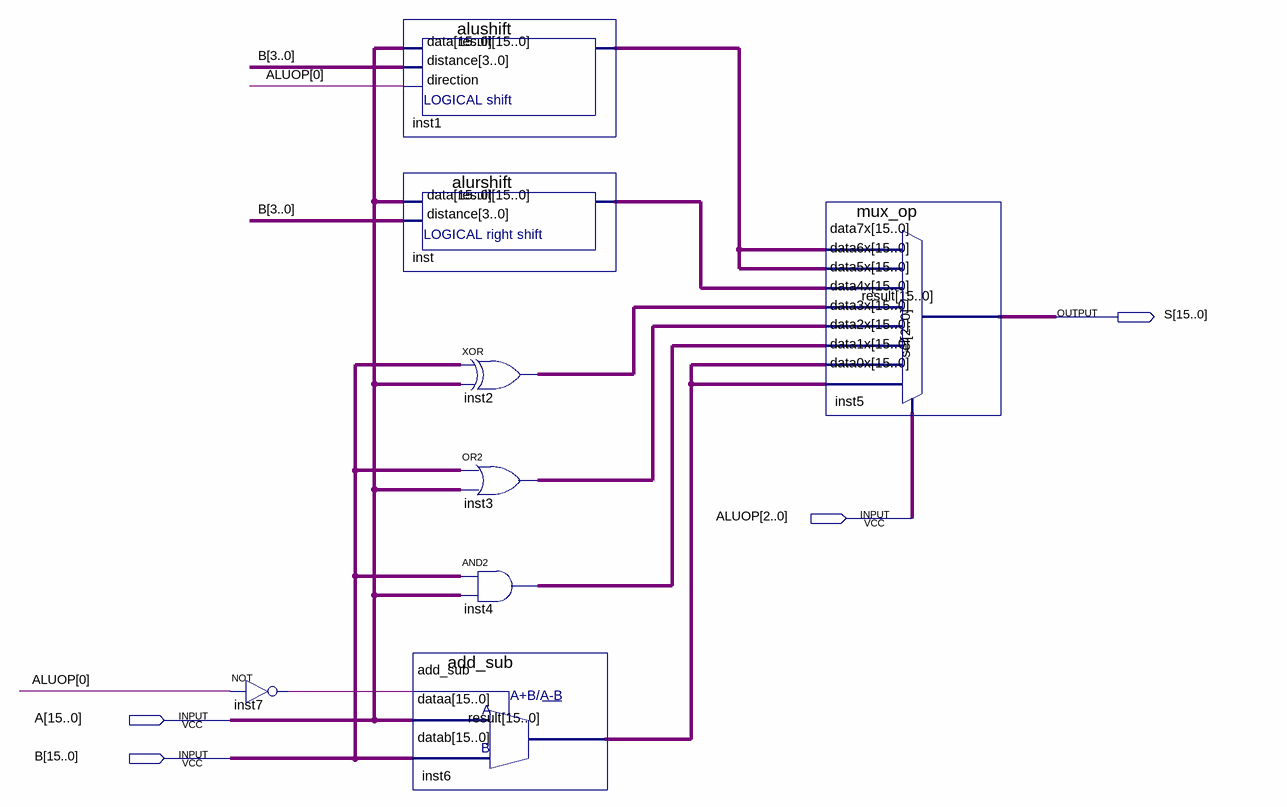
[diagram p0: schematic sheet]
// Quartus schematic alu16.bdf as structural Verilog: 8 symbols, 4 pins
module alu16 (
  input  [2:0] ALUOP,
  input  [15:0] A,
  input  [15:0] B,
  output [15:0] S
);

  wire inst7_out;
  wire [15:0] inst1_result, inst2_out, inst3_out, inst4_out, inst6_result, inst_result;

  not inst7 (inst7_out, ALUOP[0]);
  alushift inst1 (.data(A), .distance(B[3:0]), .direction(ALUOP[0]), .result(inst1_result));
  alurshift inst (.data(A), .distance(B[3:0]), .result(inst_result));
  assign inst2_out = B ^ A;  // XOR inst2, 16 bits wide
  assign inst3_out = B | A;  // OR2 inst3, 16 bits wide
  assign inst4_out = B & A;  // AND2 inst4, 16 bits wide
  add_sub inst6 (.add_sub(inst7_out), .dataa(A), .datab(B), .result(inst6_result));
  mux_op inst5 (
    .data7x(inst1_result), .data6x(inst1_result), .data5x(inst_result), .data4x(inst2_out),
    .data3x(inst3_out), .data2x(inst4_out), .data1x(inst6_result), .data0x(inst6_result), .sel(ALUOP),
    .result(S));
endmodule
